# Altium schematic sheet TYPEC_16P_SMD.schdoc
size 124 x 99 mm
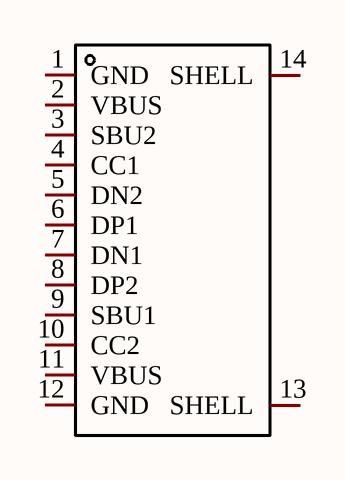
[diagram p0: TYPEC_16P_SMD.schdoc]

## Parts
USB?  TYPE-C 16PIN 2MD(073)  [USB-C-SMD_TYPE-C-6PIN-2MD-073]  (value not drawn)

## Nets

Not connected (* = marked no-connect by the designer): USB? 1(GND) 2(VBUS) 3(SBU2) 4(CC1) 5(DN2) 6(DP1) 7(DN1) 8(DP2) 9(SBU1) 10(CC2) 11(VBUS) 12(GND) 13(SHELL) 14(SHELL)

## Library data of the parts
USB? = TYPE-C 16PIN 2MD(073): Manufacturer: SHOU HAN(首韩); Add into BOM: yes; Gender: 母; Number of Ports: 1; Number of Contacts: 16P; Current Rating - Power (Max): 5A; Symbol: TYPE-C 16PIN 2MD(073); Device: TYPE-C 16PIN 2MD(073); Supplier: LCSC; Supplier Part: C2765186; Manufacturer Part: TYPE-C 16PIN 2MD(073); JLCPCB Part Class: Extended Part; LCSC Part Name: Type-C 母 卧贴; Supplier Footprint: SMD; Datasheet: https://atta.szlcsc.com/upload/public/pdf/source/20211123/39B17C16241EAC15C5E277BDA434118E.pdf; Convert to PCB: yes; Connector Type: Type-C; Standard: -; Mounting Style: 卧贴; Operating Temperature Range: -25℃~+85℃